# Altium schematic sheet USB-C Connector.SchDoc: Main Connector
size A4; Date: Dec. 27th, 2022; Author: Karl Asseily; DrawnBy: Karl Asseily; DocumentNumber: 202301191218; Revision: 1.2; SheetNumber: 6; SheetTotal: 20
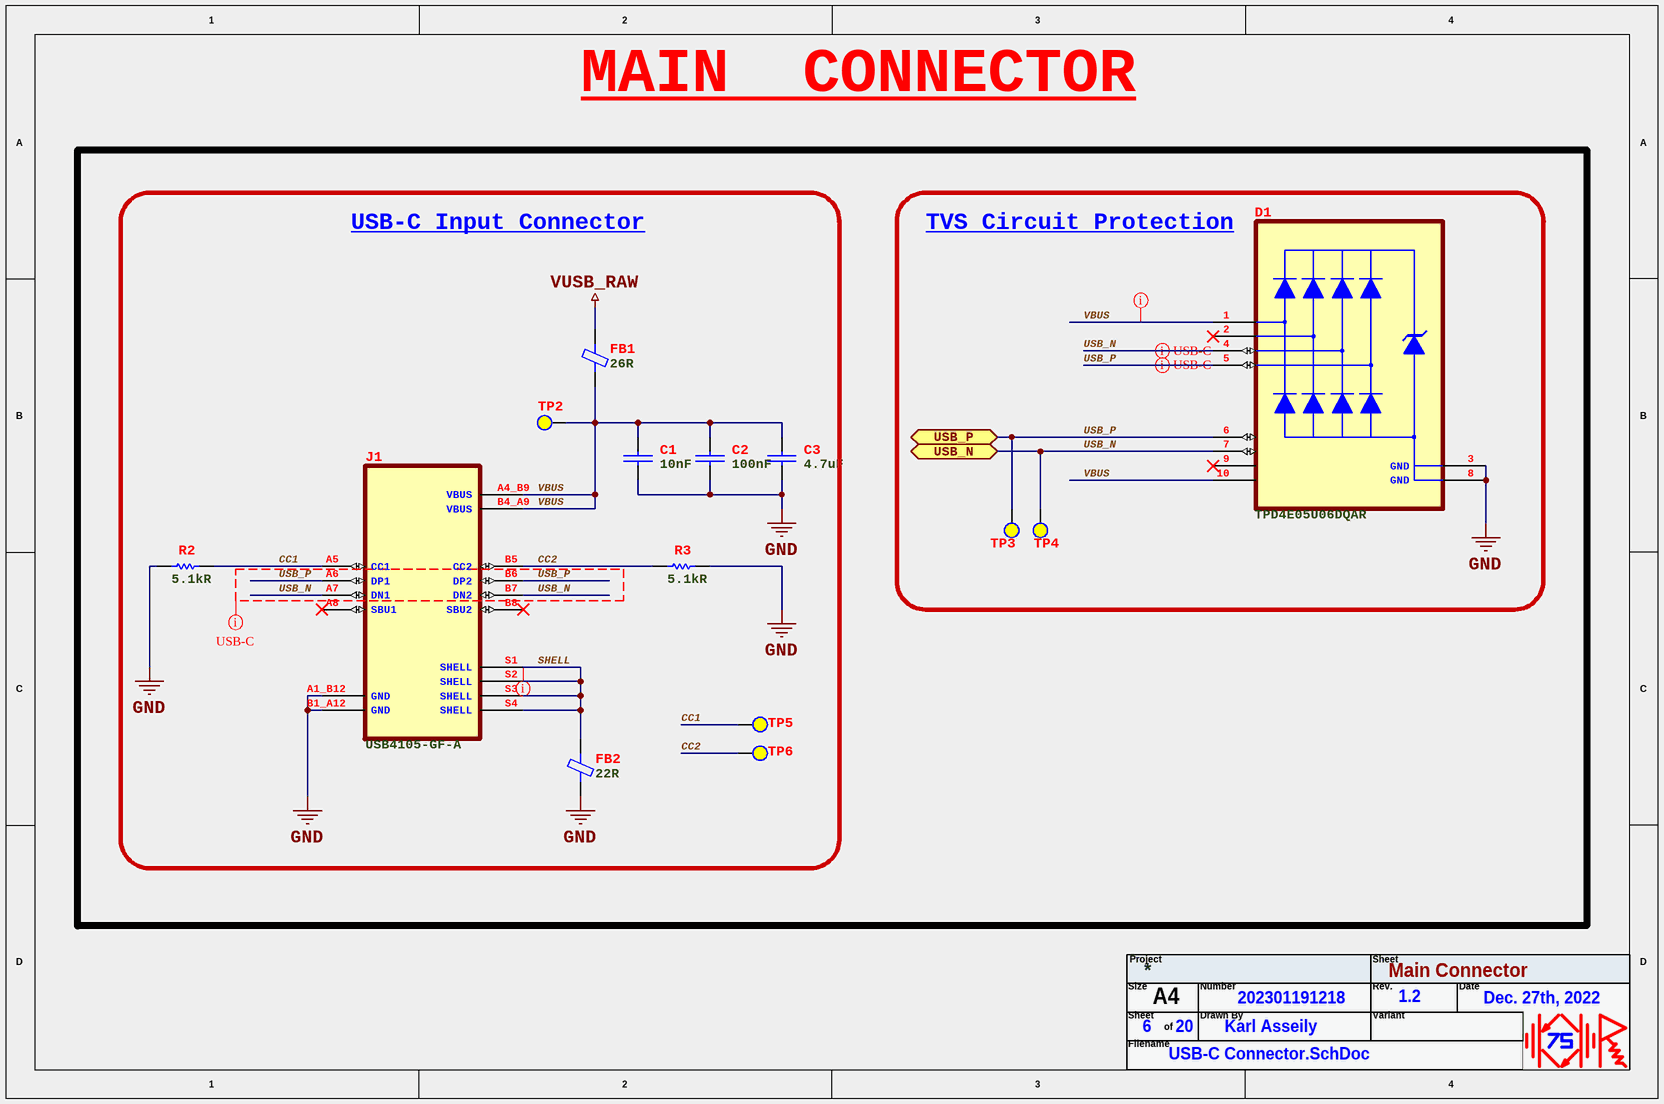
[diagram p0: USB-C Connector.SchDoc]

## Parts
C1  10nF  [CAP_0603]
C2  100nF  [CAP_0603]
C3  4.7uF  [CAP_0805]
D1  TPD4E05U06DQAR  [DIO-T-A_10-USON]
FB1  26R  [FB_0603]
FB2  22R  [FB_0603]
J1  USB4105-GF-A  [CON-RCPT_USB2.0-Type-C_GCT_USB4105-GF-A]
R2  5.1kR  [RES_0603]
R3  5.1kR  [RES_0603]
TP2  VBUS  [TEST POINT HOLE]  (value not drawn)  (no BOM)
TP3  USB_P  [TEST POINT PAD]  (value not drawn)  (no BOM)
TP4  USB_N  [TEST POINT PAD]  (value not drawn)  (no BOM)
TP5  CC1  [TEST POINT PAD]  (value not drawn)  (no BOM)
TP6  CC2  [TEST POINT PAD]  (value not drawn)  (no BOM)

## Blocks framed on the sheet
USB-C Input Connector: C1-C3 FB1 FB2 J1 R2 R3 TP2 TP5 TP6
TVS Circuit Protection: D1 TP3 TP4

## Ports
USB_N (bidir, see Power Delivery, USB-to-Serial Converter), USB_P (bidir, see Power Delivery, USB-to-Serial Converter)

## Nets
GND: C1.2 C2.2 C3.2 D1.3(GND) D1.8(GND) FB2.2 J1.A1_B12(GND) J1.B1_A12(GND) R2.2 R3.2
VUSB_RAW: FB1.2
CC1: J1.A5(CC1) R2.1 TP5.TP
CC2: J1.B5(CC2) R3.1 TP6.TP
SHELL: FB2.1 J1.S1(SHELL) J1.S2(SHELL) J1.S3(SHELL) J1.S4(SHELL)
USB_N: D1.4(D2+) D1.7(NC) J1.A7(DN1) J1.B7(DN2) TP4.TP ; port USB_N
USB_P: D1.5(D2-) D1.6(NC) J1.A6(DP1) J1.B6(DP2) TP3.TP ; port USB_P
VBUS: C1.1 C2.1 C3.1 D1.1(D1+) D1.10(NC) FB1.1 J1.A4_B9(VBUS) J1.B4_A9(VBUS) TP2.TP

Not connected (* = marked no-connect by the designer): D1 2(D1-)* 9(NC)*; J1 A8(SBU1)* B8(SBU2)*

## Layout directives
net class POWER; rule Supply Nets [Voltage = 0.000]: SHELL
differential pair; differential pair class USB: USB_N, USB_P
net class USB-C; rule Impedance Constraint [Min = 89.10    Max = 90.90    ]; rule Matched Net Lengths [Delay Tolerance = 5ps]; rule Length Constraint [Min Length = 0mil    Max Length = 1000mil]: USB_N, USB_P
net class POWER; rule Supply Nets [Voltage = 5.000]: VBUS

## Notes on the sheet
- MAIN  CONNECTOR
- Project
- Sheet
- Size
- Filename
- A4
- of
- Number
- Drawn By
- Rev.
- Variant
- Date

## Library data of the parts
C1 = CAP_10nF-50V-10%_0603: 10000 pF ±10% 50V Ceramic Capacitor X7R 0603 (1608 Metric); Manufacturer: Yageo; Manufacturer Part Number: CC0603KRX7R9BB103; Insulation Resistance: 100GR; Supplier 1: Digi-Key; RoHS: Yes; Category: Ceramic Capacitors; Stock 1: 8015125; Pricing 1: 1=0.10000, 10=0.03200, 50=0.01760, 100=0.01440, 500=0.01026, 1000=0.00805 (USD); Mounting Technology: Surface Mount; Case/Package: 0603; Pins: 2; Material: Ceramic; Case Code (Metric): 1608; Case Code (Imperial): 0603; Min Operating Temperature: -55°C; Max Operating Temperature: 125°C; Tolerance: 10%; Capacitance: 10nF; Dielectric: X7R; Voltage: 50V; Packaging: Tape and Reel; Voltage Rating: 50V; Voltage Rating (DC): 50V; Package Quantity: 1; Termination: SMD/SMT; Resistor Type: Ceramic; Series: CC; Length: 1.6mm; Width: 0.031inch; Height: 0.8mm; Thickness: 0.035inch; Depth: 0.8mm; Radiation Hardening: No; RoHS Compliant: Yes; Lead Free: Lead Free; Halogen Free: Halogen Free; ComponentLink1URL: C:\Users\Public\Documents\Altium\Projects\Cellar_Watchdog\Docs\Capacitor\UPY-GPHC_X7R_6.3V-to-250V_22.pdf; ComponentLink1Description: Datasheet; Supplier 2: Mouser; Supplier Part Number 1: 311-1085-1-ND; Supplier Part Number 2: 603-CC603KRX7R9BB103
C2 = CAP_0.1uF-50V-10%_0603: 0.1 µF ±10% 50V Ceramic Capacitor X7R 0603 (1608 Metric); Manufacturer: Yageo; Manufacturer Part Number: CC0603KRX7R9BB104; Supplier 1: Digi-Key; RoHS: Yes; Category: Ceramic Capacitors; Stock 1: 10054527; Pricing 1: 1=0.10000, 10=0.05400, 50=0.02960, 100=0.02430, 500=0.01732, 1000=0.01361 (USD); Mounting Technology: Surface Mount; Case/Package: 0603; Pins: 2; Case Code (Metric): 1608; Case Code (Imperial): 0603; Dielectric Material: Ceramic; Min Operating Temperature: -55°C; Max Operating Temperature: 125°C; Package Quantity: 1; Capacitance: 100nF; Voltage Rating: 50V; Tolerance: 10%; Packaging: Tape and Reel; Dielectric: X7R; Termination: SMD/SMT; Voltage: 50V; Series: CC; Length: 0.063inch; Width: 0.031inch; Height: 0.8mm; Thickness: 0.035inch; Depth: 0.8mm; Radiation Hardening: No; Reach SVHC Compliant: Yes; Lead Free: Lead Free; Halogen Free: Halogen Free; RoHS Compliant: Yes; ComponentLink1URL: C:\Users\Public\Documents\Altium\Projects\Cellar_Watchdog\Docs\Capacitor\UPY-GPHC_X7R_6.3V-to-250V_22.pdf; ComponentLink1Description: Datasheet; Supplier Part Number 2: 603-CC603KRX7R9BB104; Supplier Part Number 1: 311-1344-1-ND; Supplier 2: Mouser
C3 = CAP_4.7uF-25V-10%_0805: 4.7 µF ±10% 25V Ceramic Capacitor X7R 0805 (2012 Metric); Manufacturer: Yageo; Manufacturer Part Number: CC0805KKX7R8BB475; Supplier 1: Digi-Key; RoHS: Yes; Category: Ceramic Capacitors; Stock 1: 26099; Pricing 1: 1=0.39000, 10=0.27000, 50=0.18940, 100=0.16230, 500=0.12172, 1000=0.10278 (USD); Mounting Technology: Surface Mount; Case/Package: 0805; Case Code (Metric): 2012; Case Code (Imperial): 0805; Weight: 0.000194oz; Min Operating Temperature: -55°C; Max Operating Temperature: 125°C; Packaging: Tape and Reel; Capacitance: 4.7uF; Voltage Rating: 25V; Tolerance: 10%; Dielectric: X7R; Termination: SMD/SMT; Voltage Rating (DC): 25V; Package Quantity: 3000; Length: 0.079inch; Width: 0.049inch; Thickness: 0.057inch; Lead Free: Lead Free; Halogen Free: Halogen Free; RoHS Compliant: Yes; ComponentLink1URL: C:\Users\Public\Documents\Altium\Projects\Cellar_Watchdog\Docs\Capacitor\UPY-GP_NP0_16V-to-50V_18.pdf; ComponentLink1Description: Datasheet; Supplier 2: Mouser; Supplier Part Number 1: 311-1885-1-ND; Supplier Part Number 2: 603-CC805KKX7R8BB475
D1 = DIO-T-A-UNI_6V-14V-2.5A_10-USON: 14V Clamp 2.5A (8/20µs) Ipp Tvs Diode Surface Mount 10-USON (2.5x1); Manufacturer: Texas Instruments; Direction: Unidirectional; Working Voltage: 5.5V; Capacitance: 0.5pF; Number of Bidirectional Channels: 4; Min Breakdown Voltage: 6V; Peak Pulse Power: 40W; Power Line Protection: Yes; Leakage Current: 10nA; Interface: LVDS,USB,Ethernet,HDMI,PCIe,SATA; Supplier 1: Digi-Key; Manufacturer Part Number: TPD4E05U06DQAR; RoHS: Yes; Category: Integrated Circuits (ICs); Stock 1: 330722; Pricing 1: 1=0.73000, 10=0.64300, 100=0.49310, 500=0.38980, 1000=0.31184 (USD); Mount: Surface Mount; Case/Package: SON; Number of Pins: 10; Contact Plating: Gold; Min Operating Temperature: -40°C; Max Operating Temperature: 125°C; Clamping Voltage: 14V; Packaging: Tape and Reel; Package Quantity: 3000; Polarity: Unidirectional; Reverse Standoff Voltage: 5.5V; Number of Channels: 4; Breakdown Voltage: 6V; Max Power Dissipation: 40W; Termination: SMD/SMT; Operating Supply Voltage: 5.5V; Peak Pulse Current: 2.5A; Series: -; Number of Unidirectional Channels: 4; Length: 2.6mm; Depth: 1.1mm; Radiation Hardening: No; Reach SVHC Compliant: Yes; Lead Free: Lead Free; RoHS Compliant: Yes; ComponentLink1URL: C:\Users\Public\Documents\Altium\Projects\Cellar_Watchdog\Docs\Diode\tpd4e05u06.pdf; ComponentLink1Description: Datasheet; Supplier 2: Mouser; Supplier Part Number 2: 595-TPD4E05U06DQAR; Supplier Part Number 1: 296-35765-1-ND
FB1 = FB_26R-100MHz-6A_0603: 26 Ohms @ 100 MHz 1 Power Line Ferrite Bead 0603 (1608 Metric) 6A 7mOhm; Manufacturer: Murata; Manufacturer Part Number: BLM18SG260TZ1D; Supplier 1: Mouser; RoHS: Yes; Category: Ferrite Beads and Chips; Stock 1: 1330; Pricing 1: 1=0.14000, 10=0.11300, 50=0.11300, 100=0.06300, 1000=0.03800, 10000=0.03400 (USD); RoHS Compliant: Yes; ComponentLink1URL: C:\Users\Public\Documents\Altium\Projects\Cellar_Watchdog\Docs\Ferrite Bead\QNFA9122.pdf; ComponentLink1Description: Datasheet; Supplier Part Number 1: 81-BLM18SG260TZ1D; Impedance: 26R
FB2 = FB_22R-100MHz-500mA_0603: 22 Ohms @ 100 MHz 1 Signal Line Ferrite Bead 0603 (1608 Metric) 500mA 350mOhm; Manufacturer: Murata; Manufacturer Part Number: BLM18BA220SN1D; Material: Ferrite,Steel; Tolerance: 25%; Number of Lines: 1; DC Resistance (DCR): 350mR; Test Frequency: 100MHz; Shielding: Unshielded; Supplier 1: Digi-Key; RoHS: Yes; Category: Ferrite Beads and Chips; Stock 1: 75893; Pricing 1: 1=0.10000, 10=0.07600, 25=0.06800, 50=0.05000, 100=0.04320, 250=0.03408, 500=0.02878, 1000=0.02424 (USD); Case/Package: 0603; Pins: 2; Core Material: Ferrite; Case Code (Metric): 1608; Case Code (Imperial): 0603; Min Operating Temperature: -55°C; Max Operating Temperature: 125°C; Package Quantity: 1; Impedance: 22R; Packaging: Tape and Reel; Current Rating: 500mA; Max Current Rating: 500mA; Max DC Current: 500mA; Termination: SMD/SMT; DC Current: 500mA; Frequency: 100MHz; Number of Circuits: 1; Series: BLM18B; DC Resistance-Max: 350mR; Length: 1.6mm; Width: 0.8mm; Height: 0.8mm; Depth: 0.8mm; Radiation Hardening: No; Reach SVHC Compliant: Yes; Military Standard: Not; Lead Free: Lead Free; RoHS Compliant: Yes; ComponentLink1URL: C:\Users\Public\Documents\Altium\Projects\Cellar_Watchdog\Docs\Ferrite Bead\QNFA9122.pdf; ComponentLink1Description: Datasheet; Supplier 2: Mouser; Supplier Part Number 2: 81-BLM18BA220SN1D; Supplier Part Number 1: 490-1016-1-ND
J1 = CON-RCPT_USB2.0-Type-C_USB4105-GF-A: USB-C (USB TYPE-C) USB 2.0 Receptacle Connector 24 (16+8 Dummy) Position Surface Mount, Right Angle; Through Hole; Manufacturer: Global Connector Technology; ComponentLink2Description: Datasheet; ComponentLink2URL: C:\Users\Public\Documents\Altium\Projects\Cellar_Watchdog\Docs\Connector\usb4105.pdf; Supplier 1: Digi-Key; Manufacturer Part Number: USB4105-GF-A; RoHS: Yes; Category: USB Connectors; Stock 1: 73159; Pricing 1: 1=0.810000, 10=0.688000, 25=0.660000, 50=0.645800, 100=0.617700, 250=0.561560 (USD); Supplier 2: Mouser; Supplier Part Number 1: 2073-USB4105-GF-ACT-ND; Supplier Part Number 2: 640-USB4105-GF-A
R2 R3 = RES_5.1kR-100mW-1%_0603: 5.1 kOhms ±1% 0.1W, 1/10W Chip Resistor 0603 (1608 Metric) Moisture Resistant Thick Film; Manufacturer: Yageo; Manufacturer Part Number: RC0603FR-075K1L; Temperature Coefficient: 100ppm/°C; Max Power Dissipation: 100mW; Voltage Rating (DC): 50V; Supplier 1: Digi-Key; RoHS: Yes; Category: Chip SMD Resistors; Stock 1: 3842915; Pricing 1: 1=0.10000, 10=0.02100, 100=0.00850, 1000=0.00383, 2500=0.00332 (USD); Case/Package: 0603; Pins: 2; Case Code (Imperial): 0603; Case Code (Metric): 1608; Min Operating Temperature: -55°C; Max Operating Temperature: 155°C; Resistance: 5.1kR; Tolerance: 1%; Packaging: Tape and Reel; Number of Terminations: 2; Series: RC; Resistor Type: Thick Film; Power Rating: 100mW; Package Quantity: 1; Features: Moisture Resistant; Voltage Rating: 50V; Termination: SMD/SMT; Construction: Rectangular; Resistance Tolerance: 1%; Length: 0.063inch; Width: 0.031inch; Height: 0.022inch; Depth: 0.8mm; RoHS Compliant: Yes; Lead Free: Lead Free; Military Standard: Not; Reach SVHC Compliant: Yes; ComponentLink1URL: C:\Users\Public\Documents\Altium\Projects\Cellar_Watchdog\Docs\Resistor\PYu-RC_Group_51_RoHS_L_12.pdf; ComponentLink1Description: Datasheet; Supplier 2: Mouser; Supplier Part Number 1: 311-5.10KHRCT-ND; Supplier Part Number 2: 603-RC0603FR-075K1L
TP2-TP6 = Test Point: PCB Test Point; ClassName: Test Point
  TP2: Value: VBUS
  TP3: Value: USB_P
  TP4: Value: USB_N
  TP5: Value: CC1
  TP6: Value: CC2